# EAGLE schematic Timer (EAGLE 5.11)
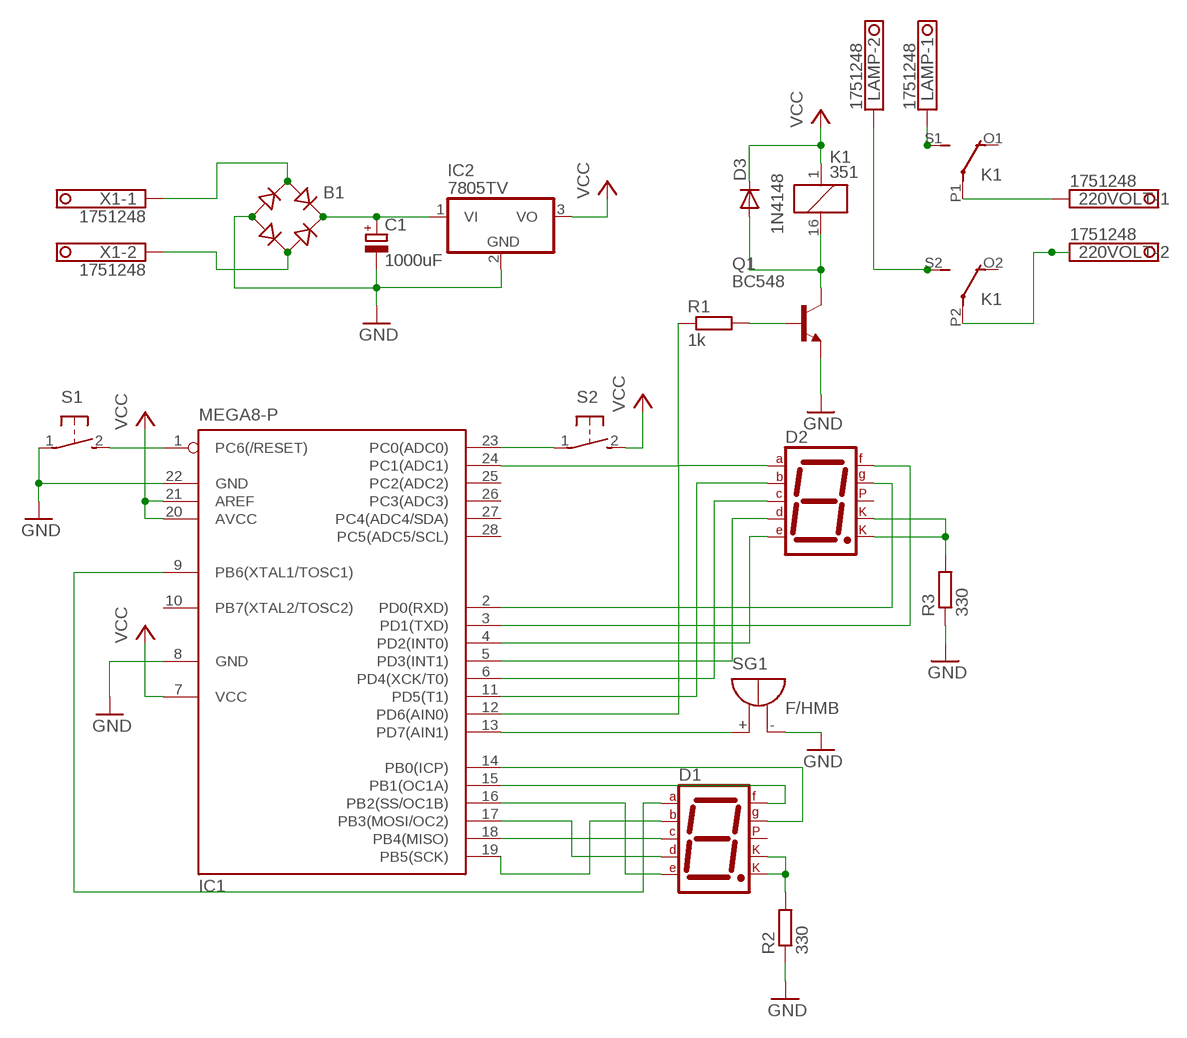
[diagram p0: schematic, sheet 1]

## Parts
220VOLT  1751248  [1751248]
B1  RB1A  [RB1A]
C1  1000uF  CPOL-EUE3.5-10  [E3,5-10]
D1  7SEG-CK  [7SEG-13]
D2  7SEG-CK  [7SEG-13]
D3  1N4148  1N4148DO35-10  [DO35-10]
IC1  MEGA8-P  [DIL28-3]
IC2  7805TV  [TO220V]
K1  351  [351]
LAMP  1751248  [1751248]
Q1  BC548  [TO92-EBC]
R1  1k  R-EU_0207/10  [0207/10]
R2  330  R-EU_0207/10  [0207/10]
R3  330  R-EU_0207/10  [0207/10]
S1  31-XX  [B3F-31XX]
S2  31-XX  [B3F-31XX]
SG1  F/HMB  [F/HMB]
X1  1751248  [1751248]

## Nets
GND: B1.- C1.- IC1.8(GND) IC1.22(GND) IC2.2(GND) Q1.E R2.1 R3.1 S1.1(P) SG1.-
N$1: B1.AC1 X1.1
N$2: 220VOLT.2 K1.P2(3:P)
N$3: B1.+ C1.+ IC2.1(VI)
N$4: IC1.13(PD7(AIN1)) SG1.+
N$5: IC1.1(PC6(/RESET)) S1.2(S)
N$6: IC1.23(PC0(ADC0)) S2.1(P)
N$7: D2.10(G) IC1.2(PD0(RXD))
N$8: D2.9(F) IC1.3(PD1(TXD))
N$9: D2.1(E) IC1.4(PD2(INT0))
N$10: D2.2(D) IC1.5(PD3(INT1))
N$11: D2.4(C) IC1.6(PD4(XCK/T0))
N$12: D2.6(B) IC1.11(PD5(T1))
N$13: D2.7(A) IC1.12(PD6(AIN0))
N$14: D1.9(F) IC1.15(PB1(OC1A))
N$15: D1.10(G) IC1.14(PB0(ICP))
N$16: D1.1(E) IC1.16(PB2(SS/OC1B))
N$17: D1.2(D) IC1.17(PB3(MOSI/OC2))
N$18: D1.4(C) IC1.18(PB4(MISO))
N$19: D1.7(A) IC1.9(PB6(XTAL1/TOSC1))
N$20: D1.6(B) IC1.19(PB5(SCK))
N$21: D1.3(CK1) D1.8(CK2) R2.2
N$22: D3.A K1.16 Q1.C
N$23: Q1.B R1.2
N$24: IC1.24(PC1(ADC1)) R1.1
N$25: 220VOLT.1 K1.P1(2:P)
N$26: B1.AC2 X1.2
N$27: K1.S2(3:S) LAMP.2
N$28: K1.S1(2:S) LAMP.1
N$29: D2.3(CK1) D2.8(CK2) R3.2
VCC: D3.C IC1.7(VCC) IC1.20(AVCC) IC1.21(AREF) IC2.3(VO) K1.1 S2.2(S)
Unconnected: D1.5(DP) D2.5(DP) IC1.10(PB7(XTAL2/TOSC2)) IC1.25(PC2(ADC2)) IC1.26(PC3(ADC3)) IC1.27(PC4(ADC4/SDA)) IC1.28(PC5(ADC5/SCL)) K1.O1(2:O) K1.O2(3:O)

## Library data of the parts
220VOLT LAMP X1 = con-phoenix-350:1751248: MKDS 1/ 2-3,5 Printklemme Nennstrom: 10 A Bemessungsspannung: 160 V Raster: 3,5 mm Polzahl: 2 Montageart: Löten Anschlussart: Schraubanschluss Anschlussrichtung vom Leiter zur Platine: 0° Source: http://eshop.phoenixcontact.com .. 1751248.pdf
B1 = rectifier:RB1A: RECTIFIER 1 A
C1 = rcl:CPOL-EU: POLARIZED CAPACITOR, European symbol
D1 D2 = special:7SEG-CK: 7-segment DISPLAY single cathode, 13 mm
D3 = diode:1N4148: DIODE high speed (Philips)
IC1 = atmel:MEGA8-P: MICROCONTROLLER 8 Kbytes FLASH, 1 kbytes SRAM, 512 bytes EEPROM, USART, 4-channel 10 bit ADC, 2-channel 8 bit ADC Pin compatible with Atmega48, ATMega88, ATMega168 Source: avr.lbr
IC2 = linear:78*: Positive VOLTAGE REGULATOR Source: http://cache.national.com/ds/LM/LM78L05.pdf http://www.fairchildsemi.com/ds/LM/LM7805.pdf
K1 = relay:351: RELAY 2 x switch, Omron
Q1 = transistor-npn:BC548*: NPN Transistor
R1-R3 = rcl:R-EU_: RESISTOR, European symbol
S1 S2 = switch-omron:31-XX: OMRON SWITCH
SG1 = buzzer:F/HMB: BUZZER Source: Buerklin